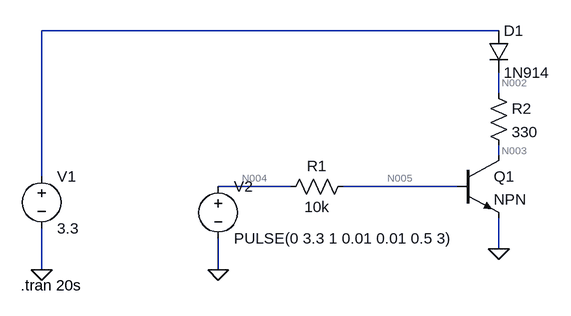
[diagram p0: schematic schemat.asc]
schemat.asc, the LTspice schematic file:
Version 4
SHEET 1 880 680
WIRE -224 -240 -928 -240
WIRE -224 -144 -224 -176
WIRE -224 -48 -224 -64
WIRE -928 -16 -928 -240
WIRE -544 0 -656 0
WIRE -288 0 -464 0
WIRE -224 96 -224 48
WIRE -928 128 -928 64
WIRE -656 128 -656 80
FLAG -928 128 0
FLAG -224 96 0
FLAG -656 128 0
SYMBOL res -448 -16 R90
WINDOW 0 0 56 VBottom 2
WINDOW 3 32 56 VTop 2
SYMATTR InstName R1
SYMATTR Value 10k
SYMBOL voltage -928 -32 R0
WINDOW 123 0 0 Left 0
WINDOW 39 0 0 Left 0
SYMATTR InstName V1
SYMATTR Value 3.3
SYMBOL npn -288 -48 R0
SYMATTR InstName Q1
SYMBOL res -240 -160 R0
SYMATTR InstName R2
SYMATTR Value 330
SYMBOL diode -240 -240 R0
SYMATTR InstName D1
SYMATTR Value 1N914
SYMATTR Description Light Emitting Diode
SYMATTR Type led
SYMBOL voltage -656 -16 R0
WINDOW 123 0 0 Left 0
WINDOW 39 0 0 Left 0
SYMATTR InstName V2
SYMATTR Value PULSE(0 3.3 1 0.01 0.01 0.5 3)
TEXT -960 152 Left 2 !.tran 20s

The netlist it stands for:
* schemat.asc
R1 N005 N004 10k
V1 N001 0 3.3
Q1 N003 N005 0 0 NPN
R2 N002 N003 330
D1 N001 N002 1N914
V2 N004 0 PULSE(0 3.3 1 0.01 0.01 0.5 3)
.model D D
.lib standard.dio
.model NPN NPN
.model PNP PNP
.lib standard.bjt
.tran 20s
.backanno
.end

* Results of the author's LTspice run, read from the files saved beside the schematic
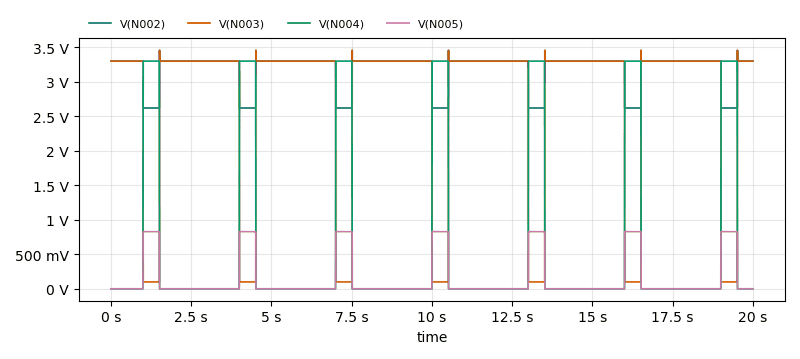
[diagram p1: Transient Analysis of schemat.asc, plotted from the saved traces]
* Transient Analysis, 1 run:
*   V(N002): min 2.619 V, max 3.456 V, average 3.177 V, rms 3.188 V, last 3.3 V
*   V(N003): min 99.9 mV, max 3.456 V, average 2.725 V, rms 2.988 V, last 3.3 V
*   V(N004): min 0 V, max 3.3 V, average 589 mV, rms 1.39 V, last 0 V
*   V(N005): min 0 V, max 827.9 mV, average 149.9 mV, rms 352 mV, last 0 V